# EAGLE design Hub (EAGLE 7.6.0)
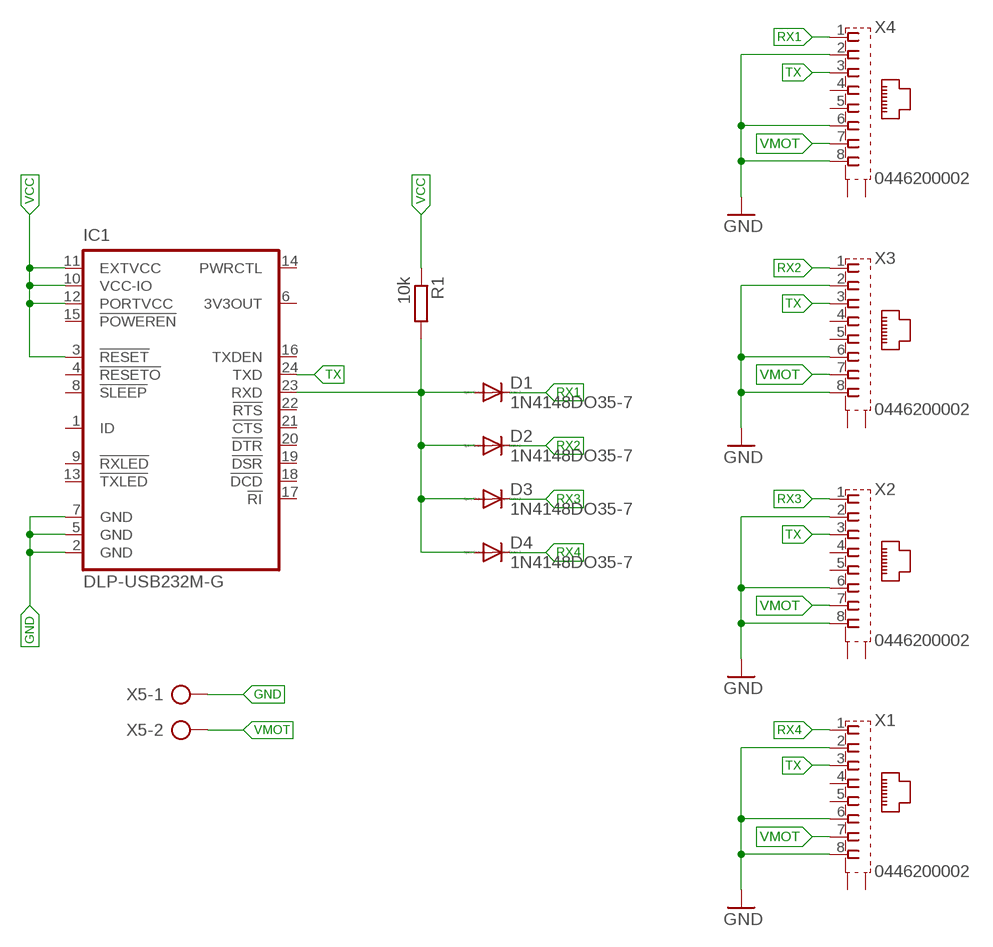
[diagram p0: schematic, sheet 1]

## Parts
D1  1N4148DO35-7  [DO35-7]
D2  1N4148DO35-7  [DO35-7]
D3  1N4148DO35-7  [DO35-7]
D4  1N4148DO35-7  [DO35-7]
IC1  DLP-USB232M-G  [DLP-USB232M]
R1  10k  R-EU_0204/7  [0204/7]
X1  0446200002  [0446200002]
X2  0446200002  [0446200002]
X3  0446200002  [0446200002]
X4  0446200002  [0446200002]
X5  AK500/2  [AK500/2]

## Nets
GND: IC1.2(GND) IC1.5(GND) IC1.7(GND) X1.2 X1.6 X1.8 X2.2 X2.6 X2.8 X3.2 X3.6 X3.8 X4.2 X4.6 X4.8 X5.1
N$5: D1.A D2.A D3.A D4.A IC1.23(RXD) R1.2
RX1: D1.C X4.1
RX2: D2.C X3.1
RX3: D3.C X2.1
RX4: D4.C X1.1
TX: IC1.24(TXD) X1.3 X2.3 X3.3 X4.3
VCC: IC1.3(!RESET) IC1.10(VCC-IO) IC1.11(EXTVCC) IC1.12(PORTVCC) R1.1
VMOT: X1.7 X2.7 X3.7 X4.7 X5.2
Unconnected: IC1.1(ID) IC1.4(!RESETO) IC1.6(3V3OUT) IC1.8(!SLEEP) IC1.9(!RXLED) IC1.13(!TXLED) IC1.14(PWRCTL) IC1.15(!POWEREN) IC1.16(TXDEN) IC1.17(!RI) IC1.18(!DCD) IC1.19(!DSR) IC1.20(!DTR) IC1.21(!CTS) IC1.22(!RTS) X1.4 X1.5 X1.S@1(S1) X1.S@2(S2) X2.4 X2.5 X2.S@1(S1) X2.S@2(S2) X3.4 X3.5 X3.S@1(S1) X3.S@2(S2) X4.4 X4.5 X4.S@1(S1) X4.S@2(S2)

## Library data of the parts
D1-D4 = diode:1N4148: DIODE high speed (Philips)
IC1 = ftdichip:DLP-USB232M-G: DLP-USB232M-G USB - SERIAL UART Interface Module Source: http://www.ftdichip.com/Documents/DataSheets/DLP/dlp-usb232m15.pdf; OC_FARNELL: unknown; OC_NEWARK: unknown
R1 = resistor:R-EU_: RESISTOR, European symbol
X1-X4 = con-molex:0446200002: RJ-45 INVERTED MODULAR JACK ASSEMBLY WITH RJ-11 KEEPOUT FEATURE Source: Data sheet <http://www.farnell.com/datasheets/73207.pdf> MOLEX 0446200002 BUCHSE, RJ45, GESCHIRMT Source: Farnell <http://de.farnell.com/molex/0446200002/buchse-rj45-geschirmt/dp/9251910?ost=9251910>; MF: MOLEX; MPN: 0446200002; OC_FARNELL: 9251910
X5 = con-ptr500:AK500/2: CONNECTOR; OC_FARNELL: unknown; OC_NEWARK: unknown

## Board
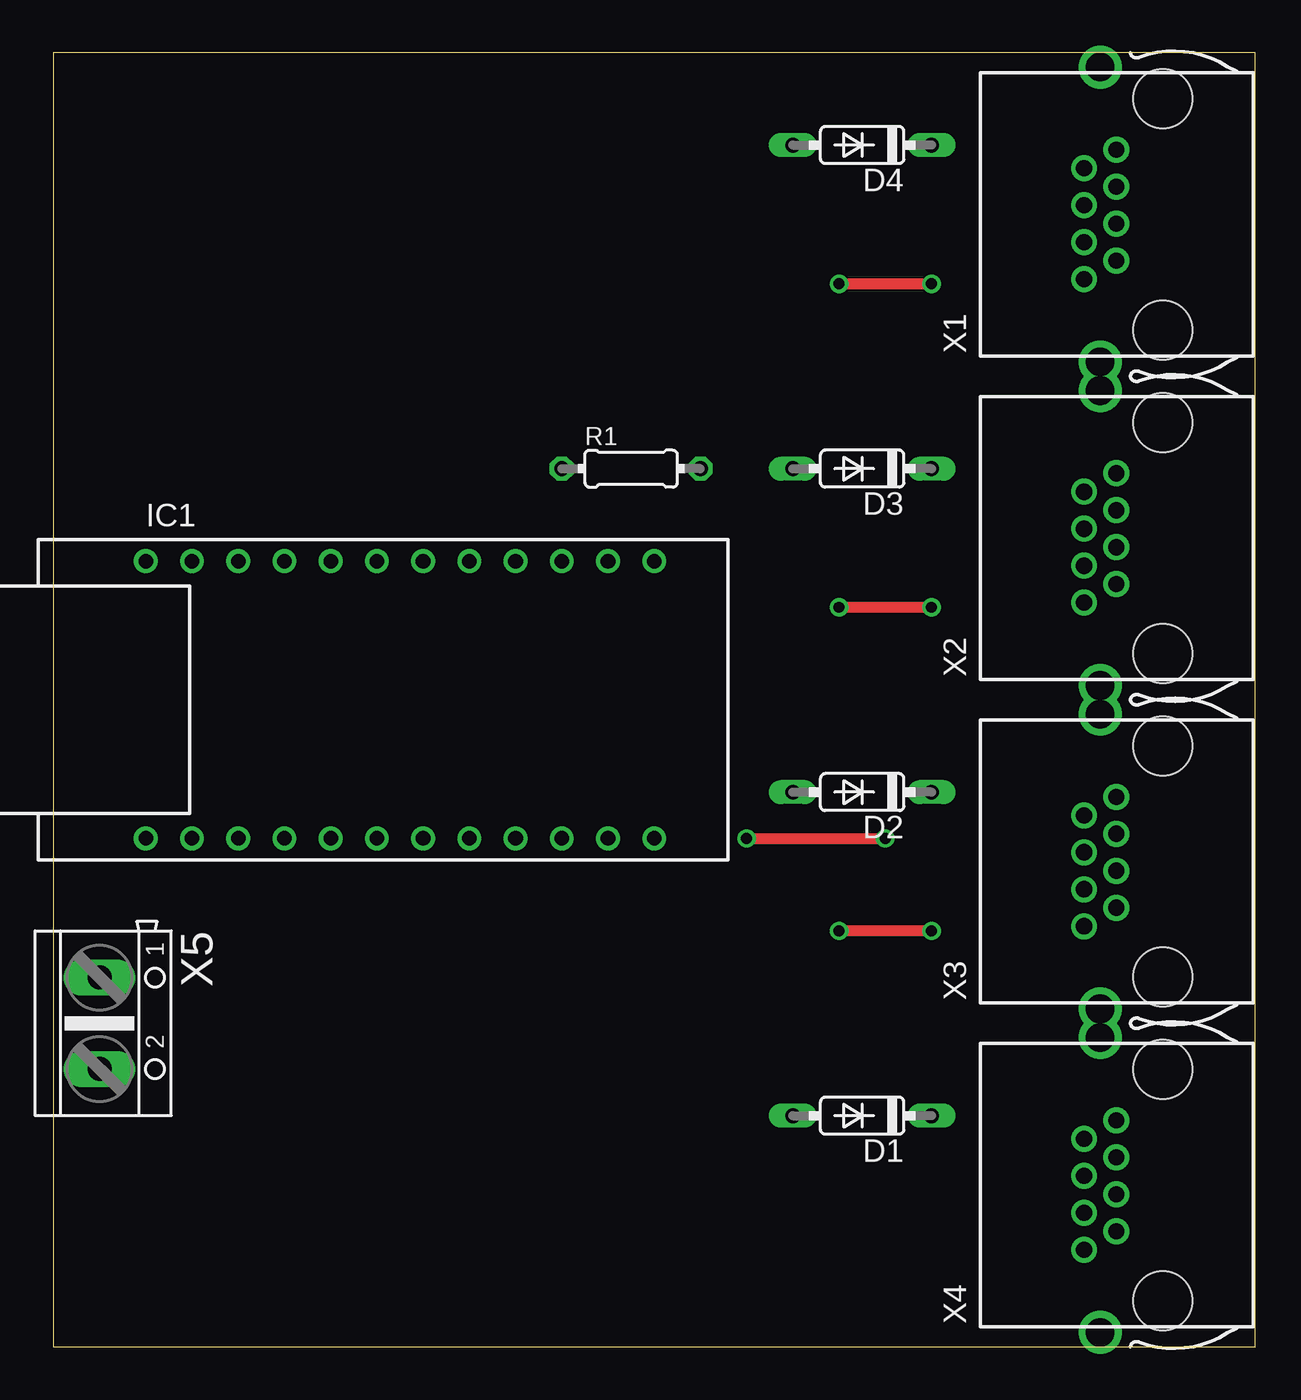
[diagram p1: board, top side]
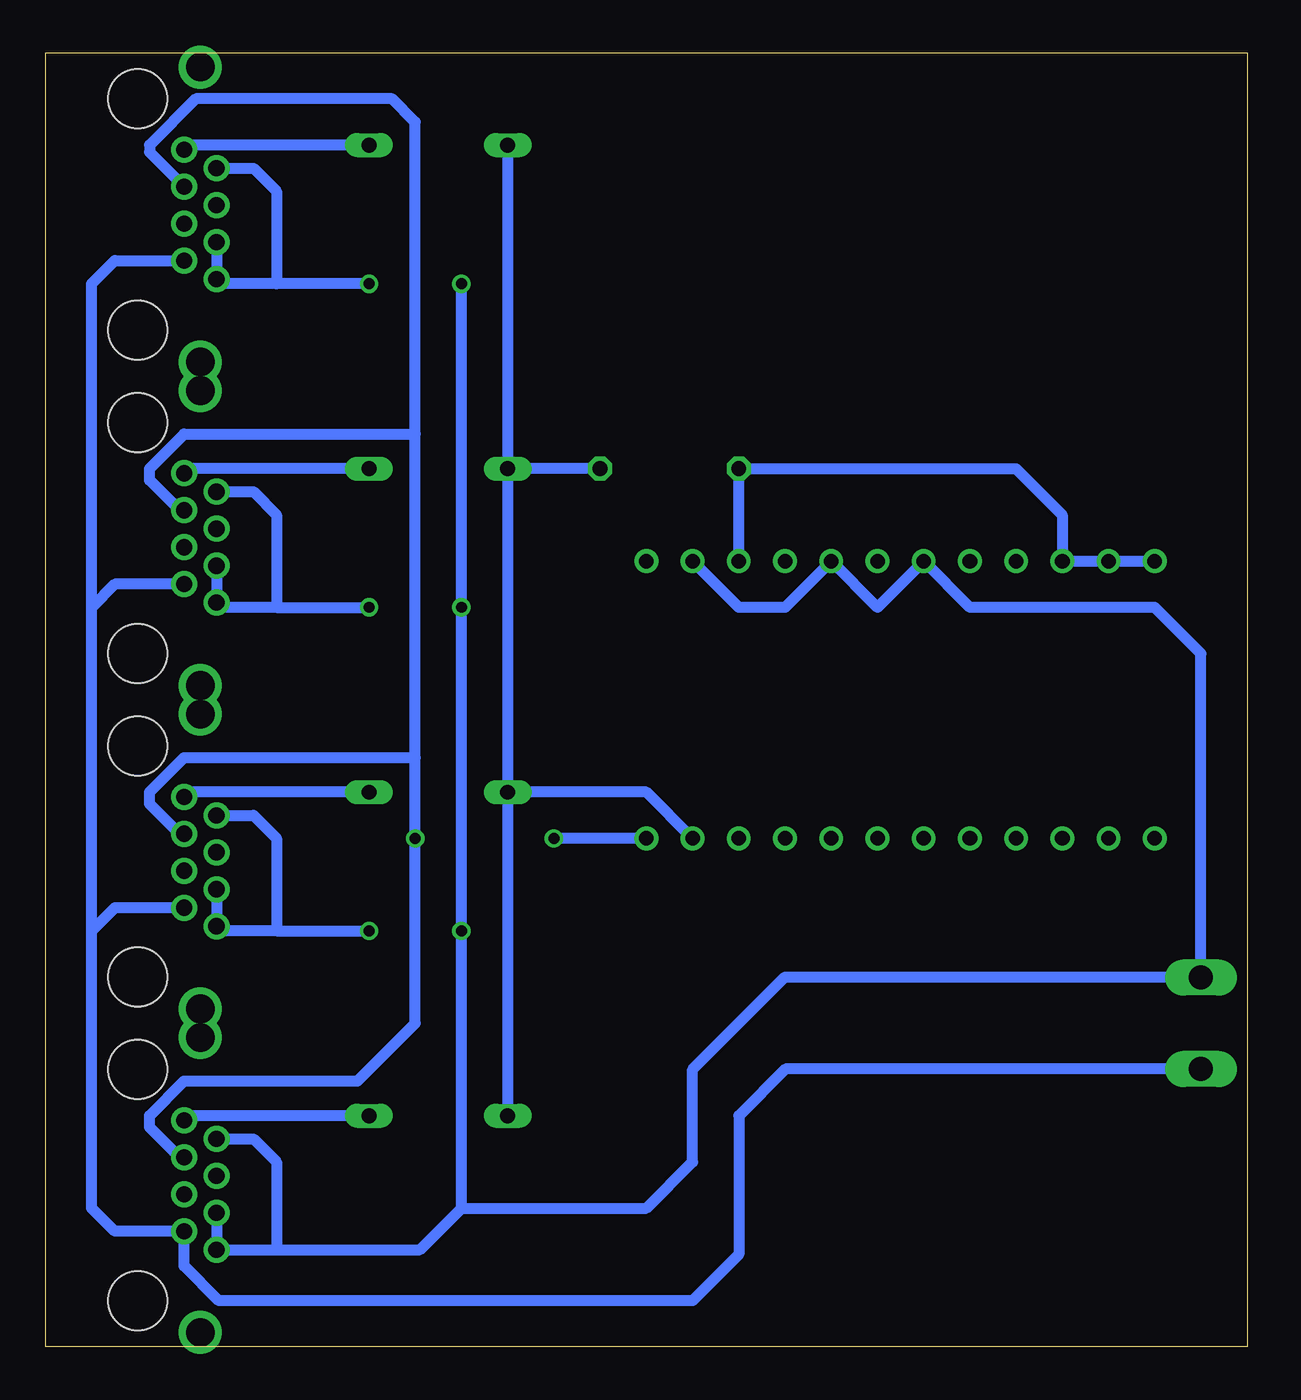
[diagram p2: board, bottom side, seen from below]

Size 66.04 x 71.12 mm. Coordinates in mm from the lower left corner, seen from the top.
Outline: 0,0 66.04,0 66.04,71.12 0,71.12 0,0
Copper layers (1*16): Top 0.035mm / dielectric 1.5mm / Bottom 0.035mm
Design rules "default": minimum track width 10mil, minimum drill 24mil, track to track 8mil, track to pad 8mil, pad to pad 8mil, via to via 8mil, smd to smd 8mil, copper to edge 40mil, drill to drill 8mil, minimum pad ring 10mil, minimum via ring 8mil, stop-mask expansion 4mil, vias tented up to drill 0mil, thermal gap 10mil

### Footprints (pad centres in the part's own frame; a part is rotated, then mirrored left to right if it is on the bottom)
DO35-7 = drill 0.813 long: A 3.81,0; C -3.81,0
DLP-USB232M = drill 0.8 pad 1.27: 1 -7.62,27.94; 2 -7.62,25.4; 3 -7.62,22.86; 4 -7.62,20.32; 5 -7.62,17.78; 6 -7.62,15.24; 7 -7.62,12.7; 8 -7.62,10.16; 9 -7.62,7.62; 10 -7.62,5.08; 11 -7.62,2.54; 12 -7.62,0; 13 7.62,0; 14 7.62,2.54; 15 7.62,5.08; 16 7.62,7.62; 17 7.62,10.16; 18 7.62,12.7; 19 7.62,15.24; 20 7.62,17.78; 21 7.62,20.32; 22 7.62,22.86; 23 7.62,25.4; 24 7.62,27.94
0204/7 = drill 0.813 octagon: 1 -3.81,0; 2 3.81,0
0446200002 = drill 0.889 pad 1.422: 1 3.556,2.54; 2 2.54,4.318; 3 1.524,2.54; 4 0.508,4.318; 5 -0.508,2.54; 6 -1.524,4.318; 7 -2.54,2.54; 8 -3.556,4.318 | drill 1.575 pad 2.286: S@1 -8.103,3.429; S@2 8.103,3.429 | hole 3.251: 6.35,0; -6.35,0
AK500/2 = drill 1.321 long: 1 -2.515,0; 2 2.515,0

### Placement (x,y rotation side)
D1  44.45,12.7 180 top
D2  44.45,30.48 180 top
D3  44.45,48.26 180 top
D4  44.45,66.04 180 top
IC1  5.08,35.56 270 top
R1  31.75,48.26 0 top
X1  60.96,62.23 90 top
X2  60.96,44.45 90 top
X3  60.96,26.67 90 top
X4  60.96,8.89 90 top
X5  2.54,17.78 270 top

### Tracks (layer width: path | path; a pad name or v marks a point on that pad's centre or on a via)
GND  (via drill 0.6)
  Top 0.61: v43.18,58.42 v48.26,58.42 | v48.26,40.64 v43.18,40.64 | v48.26,22.86 v43.18,22.86
  Bottom 0.61: 53.34,5.33 X4.8 X4.6 | 53.34,5.33 45.47,5.33 43.18,7.62 | 43.18,7.62 v43.18,22.86 v43.18,40.64 v43.18,58.42 | v48.26,58.42 53.34,58.42 | 53.34,58.42 56.39,58.42 X1.8 X1.6 | X1.2 54.61,64.77 53.34,63.5 53.34,58.42 | X2.2 54.61,46.99 53.34,45.72 53.34,40.64 | 53.34,40.64 v48.26,40.64 | X2.6 X2.8 56.39,40.64 53.34,40.64 | X3.2 54.61,29.21 53.34,27.94 53.34,22.86 | 53.34,22.86 v48.26,22.86 | X3.6 X3.8 56.39,22.86 53.34,22.86 | X4.2 54.61,11.43 53.34,10.16 53.34,5.33 | IC1.2 27.94,40.64 25.4,40.64 IC1.5 20.32,40.64 IC1.7 15.24,40.64 5.08,40.64 2.54,38.1 X5.1 2.56,20.32 25.4,20.32 30.48,15.24 30.48,10.16 33.02,7.62 43.18,7.62
N$5
  Bottom 0.61: R1.2 D3.A | D4.A D3.A | D3.A D2.A | D2.A D1.A | IC1.23 33.02,30.48 D2.A
RX1
  Bottom 0.61: D1.C 58.17,12.7 X4.1
RX2
  Bottom 0.61: D2.C 58.17,30.48 X3.1
RX3
  Bottom 0.61: D3.C 58.17,48.26 X2.1
RX4
  Bottom 0.61: D4.C 58.17,66.04 X1.1
TX  (via drill 0.6)
  Top 0.61: v38.1,27.94 v45.72,27.94
  Bottom 0.61: X4.3 58.67,10.41 60.33,12.06 60.33,12.7 58.42,14.61 48.9,14.61 45.72,17.78 v45.72,27.94 45.72,32.38 | 45.72,32.38 45.72,50.16 | 45.72,50.16 45.72,67.31 46.99,68.58 57.78,68.58 60.33,66.04 60.33,65.66 X1.3 | X3.3 58.67,28.19 60.33,29.84 60.33,30.48 58.42,32.38 45.72,32.38 | X2.3 58.67,45.97 60.33,47.62 60.33,48.26 58.42,50.16 45.72,50.16 | IC1.24 v38.1,27.94
VCC
  Bottom 0.61: IC1.3 R1.1 12.7,48.26 10.16,45.72 IC1.10 IC1.11 IC1.12
VMOT
  Bottom 0.61: X5.2 25.38,15.27 27.94,12.7 27.94,5.08 30.48,2.54 56.52,2.54 58.42,4.45 X4.7 62.23,6.35 63.5,7.62 63.5,22.86 | 63.5,22.86 63.5,40.64 | 63.5,40.64 63.5,58.42 62.23,59.69 X1.7 | X2.7 62.23,41.91 63.5,40.64 | X3.7 62.23,24.13 63.5,22.86